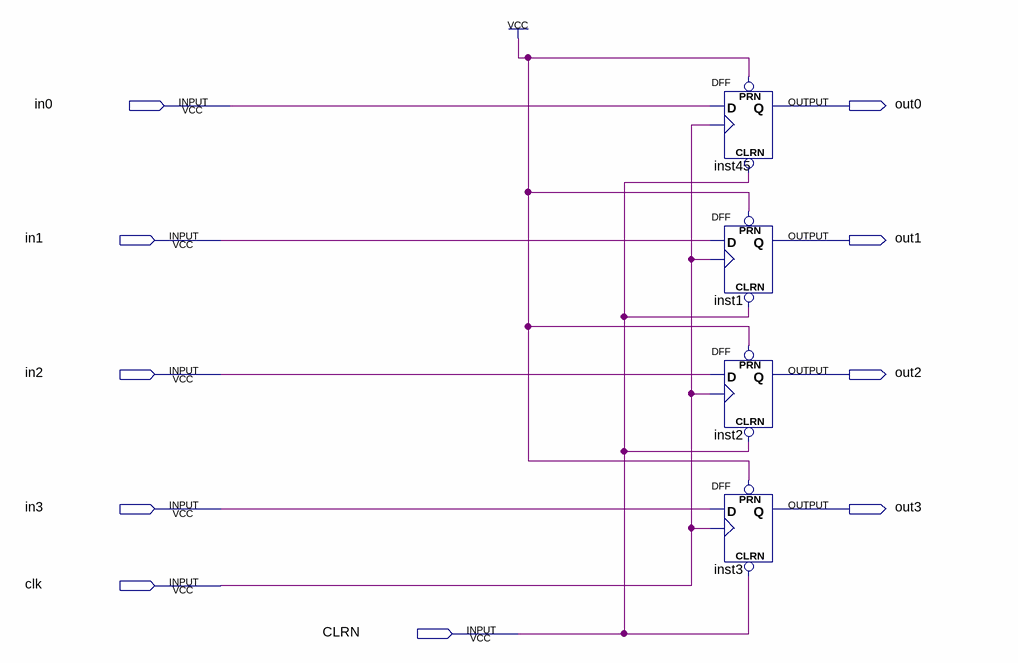
[diagram p0: schematic sheet]
// Quartus schematic register4bits.bdf as structural Verilog: 4 symbols, 10 pins
module register4bits (
  input  in0,
  input  in1,
  input  in2,
  input  in3,
  input  clk,
  input  CLRN,
  output out0,
  output out1,
  output out2,
  output out3
);

  DFF inst45 (.CLRN(CLRN), .CLK(clk), .D(in0), .PRN(1'b1), .Q(out0));
  DFF inst1 (.CLRN(CLRN), .CLK(clk), .D(in1), .PRN(1'b1), .Q(out1));
  DFF inst2 (.CLRN(CLRN), .CLK(clk), .D(in2), .PRN(1'b1), .Q(out2));
  DFF inst3 (.CLRN(CLRN), .CLK(clk), .D(in3), .PRN(1'b1), .Q(out3));
endmodule
